# EAGLE design 4H-Charlieplex84 (EAGLE 7.5.0)
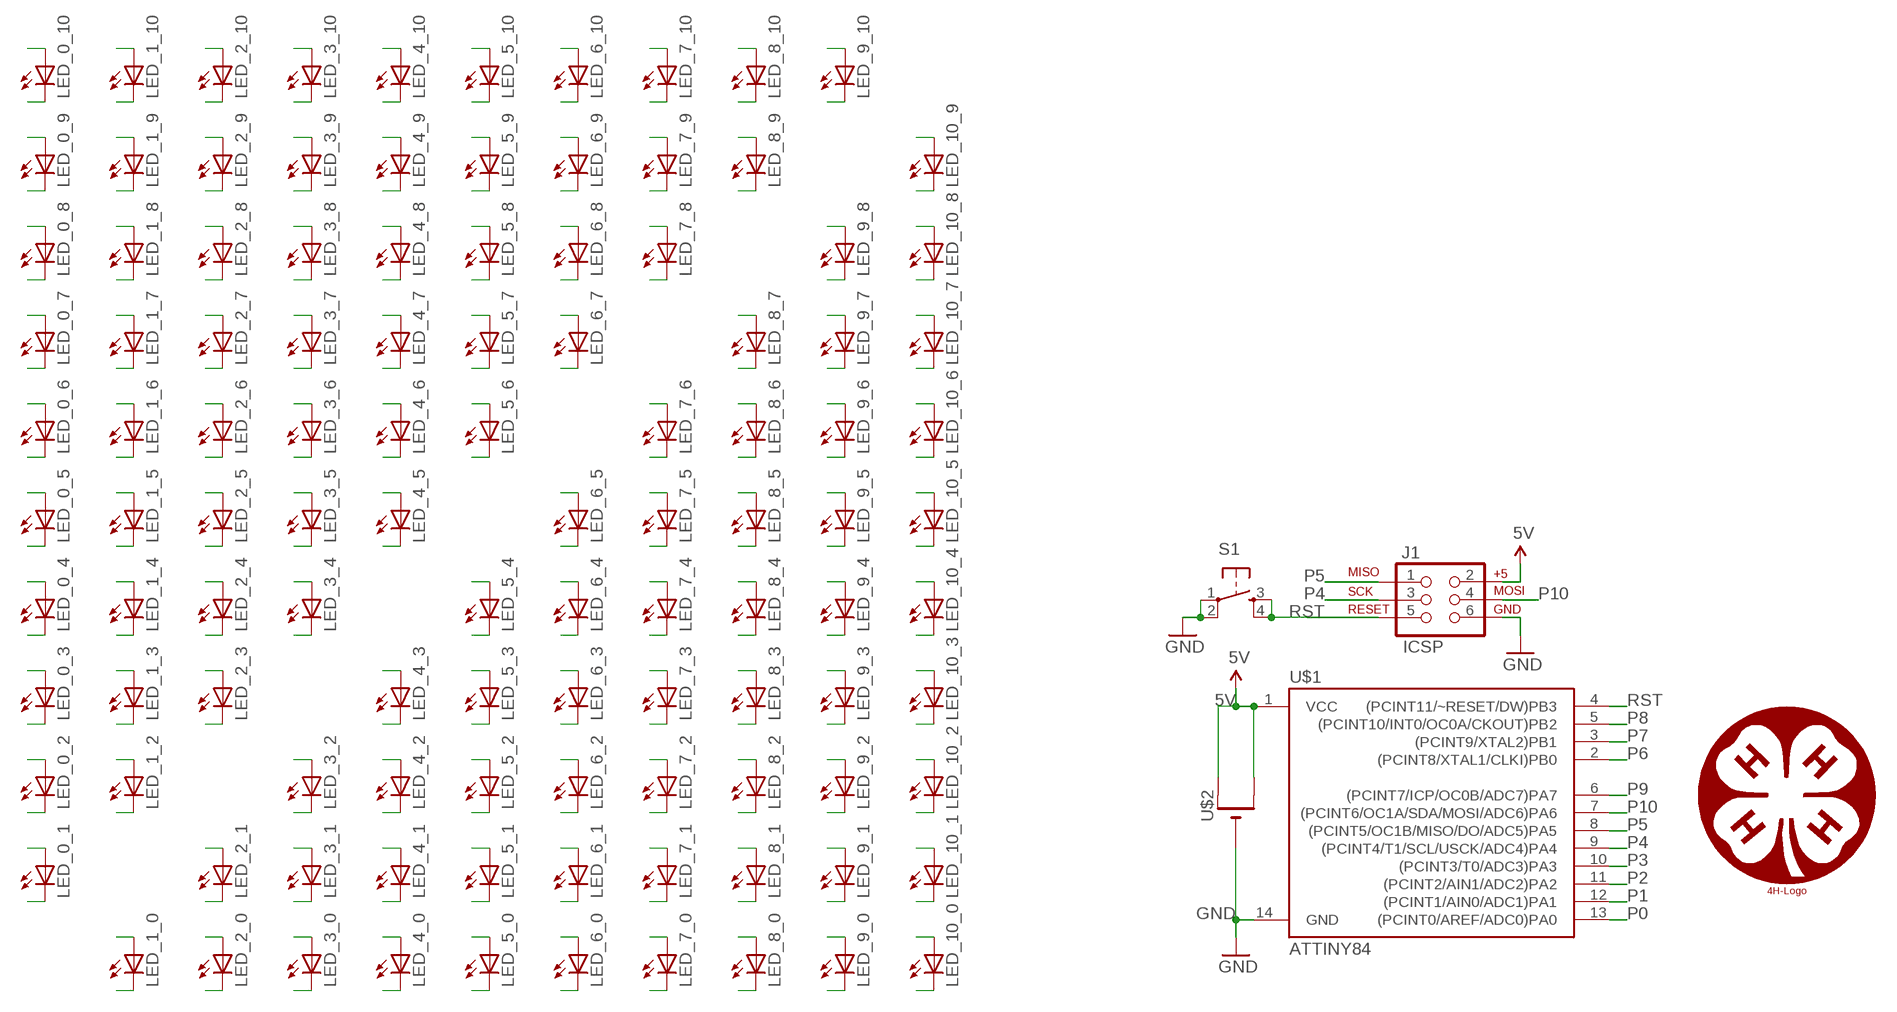
[diagram p0: schematic, sheet 1]

## Parts
J1  ICSP  AVR_SPI_PRG_6LABELED  [2X3-NS]
LED_0_1  LEDOVAL  [LED-OVAL]
LED_0_2  LEDOVAL  [LED-OVAL]
LED_0_3  LEDOVAL  [LED-OVAL]
LED_0_4  LEDOVAL  [LED-OVAL]
LED_0_5  LEDOVAL  [LED-OVAL]
LED_0_6  LEDOVAL  [LED-OVAL]
LED_0_7  LEDOVAL  [LED-OVAL]
LED_0_8  LEDOVAL  [LED-OVAL]
LED_0_9  LEDOVAL  [LED-OVAL]
LED_0_10  LEDOVAL  [LED-OVAL]
LED_1_0  LEDOVAL  [LED-OVAL]
LED_1_2  LEDOVAL  [LED-OVAL]
LED_1_3  LEDOVAL  [LED-OVAL]
LED_1_4  LEDOVAL  [LED-OVAL]
LED_1_5  LEDOVAL  [LED-OVAL]
LED_1_6  LEDOVAL  [LED-OVAL]
LED_1_7  LEDOVAL  [LED-OVAL]
LED_1_8  LEDOVAL  [LED-OVAL]
LED_1_9  LEDOVAL  [LED-OVAL]
LED_1_10  LEDOVAL  [LED-OVAL]
LED_2_0  LEDOVAL  [LED-OVAL]
LED_2_1  LEDOVAL  [LED-OVAL]
LED_2_3  LEDOVAL  [LED-OVAL]
LED_2_4  LEDOVAL  [LED-OVAL]
LED_2_5  LEDOVAL  [LED-OVAL]
LED_2_6  LEDOVAL  [LED-OVAL]
LED_2_7  LEDOVAL  [LED-OVAL]
LED_2_8  LEDOVAL  [LED-OVAL]
LED_2_9  LEDOVAL  [LED-OVAL]
LED_2_10  LEDOVAL  [LED-OVAL]
LED_3_0  LEDOVAL  [LED-OVAL]
LED_3_1  LEDOVAL  [LED-OVAL]
LED_3_2  LEDOVAL  [LED-OVAL]
LED_3_4  LEDOVAL  [LED-OVAL]
LED_3_5  LEDOVAL  [LED-OVAL]
LED_3_6  LEDOVAL  [LED-OVAL]
LED_3_7  LEDOVAL  [LED-OVAL]
LED_3_8  LEDOVAL  [LED-OVAL]
LED_3_9  LEDOVAL  [LED-OVAL]
LED_3_10  LEDOVAL  [LED-OVAL]
LED_4_0  LEDOVAL  [LED-OVAL]
LED_4_1  LEDOVAL  [LED-OVAL]
LED_4_2  LEDOVAL  [LED-OVAL]
LED_4_3  LEDOVAL  [LED-OVAL]
LED_4_5  LEDOVAL  [LED-OVAL]
LED_4_6  LEDOVAL  [LED-OVAL]
LED_4_7  LEDOVAL  [LED-OVAL]
LED_4_8  LEDOVAL  [LED-OVAL]
LED_4_9  LEDOVAL  [LED-OVAL]
LED_4_10  LEDOVAL  [LED-OVAL]
LED_5_0  LEDOVAL  [LED-OVAL]
LED_5_1  LEDOVAL  [LED-OVAL]
LED_5_2  LEDOVAL  [LED-OVAL]
LED_5_3  LEDOVAL  [LED-OVAL]
LED_5_4  LEDOVAL  [LED-OVAL]
LED_5_6  LEDOVAL  [LED-OVAL]
LED_5_7  LEDOVAL  [LED-OVAL]
LED_5_8  LEDOVAL  [LED-OVAL]
LED_5_9  LEDOVAL  [LED-OVAL]
LED_5_10  LEDOVAL  [LED-OVAL]
LED_6_0  LEDOVAL  [LED-OVAL]
LED_6_1  LEDOVAL  [LED-OVAL]
LED_6_2  LEDOVAL  [LED-OVAL]
LED_6_3  LEDOVAL  [LED-OVAL]
LED_6_4  LEDOVAL  [LED-OVAL]
LED_6_5  LEDOVAL  [LED-OVAL]
LED_6_7  LEDOVAL  [LED-OVAL]
LED_6_8  LEDOVAL  [LED-OVAL]
LED_6_9  LEDOVAL  [LED-OVAL]
LED_6_10  LEDOVAL  [LED-OVAL]
LED_7_0  LEDOVAL  [LED-OVAL]
LED_7_1  LEDOVAL  [LED-OVAL]
LED_7_2  LEDOVAL  [LED-OVAL]
LED_7_3  LEDOVAL  [LED-OVAL]
LED_7_4  LEDOVAL  [LED-OVAL]
LED_7_5  LEDOVAL  [LED-OVAL]
LED_7_6  LEDOVAL  [LED-OVAL]
LED_7_8  LEDOVAL  [LED-OVAL]
LED_7_9  LEDOVAL  [LED-OVAL]
LED_7_10  LEDOVAL  [LED-OVAL]
LED_8_0  LEDOVAL  [LED-OVAL]
LED_8_1  LEDOVAL  [LED-OVAL]
LED_8_2  LEDOVAL  [LED-OVAL]
LED_8_3  LEDOVAL  [LED-OVAL]
LED_8_4  LEDOVAL  [LED-OVAL]
LED_8_5  LEDOVAL  [LED-OVAL]
LED_8_6  LEDOVAL  [LED-OVAL]
LED_8_7  LEDOVAL  [LED-OVAL]
LED_8_9  LEDOVAL  [LED-OVAL]
LED_8_10  LEDOVAL  [LED-OVAL]
LED_9_0  LEDOVAL  [LED-OVAL]
LED_9_1  LEDOVAL  [LED-OVAL]
LED_9_2  LEDOVAL  [LED-OVAL]
LED_9_3  LEDOVAL  [LED-OVAL]
LED_9_4  LEDOVAL  [LED-OVAL]
LED_9_5  LEDOVAL  [LED-OVAL]
LED_9_6  LEDOVAL  [LED-OVAL]
LED_9_7  LEDOVAL  [LED-OVAL]
LED_9_8  LEDOVAL  [LED-OVAL]
LED_9_10  LEDOVAL  [LED-OVAL]
LED_10_0  LEDOVAL  [LED-OVAL]
LED_10_1  LEDOVAL  [LED-OVAL]
LED_10_2  LEDOVAL  [LED-OVAL]
LED_10_3  LEDOVAL  [LED-OVAL]
LED_10_4  LEDOVAL  [LED-OVAL]
LED_10_5  LEDOVAL  [LED-OVAL]
LED_10_6  LEDOVAL  [LED-OVAL]
LED_10_7  LEDOVAL  [LED-OVAL]
LED_10_8  LEDOVAL  [LED-OVAL]
LED_10_9  LEDOVAL  [LED-OVAL]
S1  TAC_SWITCHPTH  [TACTILE-PTH]
U$1  ATTINY84  ATTINY84ATTINY84-20PU  [DIL14]
U$2  CR2032THM  [CR2032-THRU]
U$3  4H-LOGO6  [4H_LOGO_6]

## Nets
5V: J1.2 U$1.1(VCC) U$2.+1(+) U$2.+2(+1)
GND: J1.6 S1.1 S1.2 U$1.14(GND) U$2.-
P0: LED_0_1.CATHODE(C) LED_0_2.CATHODE(C) LED_0_3.CATHODE(C) LED_0_4.CATHODE(C) LED_0_5.CATHODE(C) LED_0_6.CATHODE(C) LED_0_7.CATHODE(C) LED_0_8.CATHODE(C) LED_0_9.CATHODE(C) LED_0_10.CATHODE(C) LED_1_0.ANODE(A) LED_2_0.ANODE(A) LED_3_0.ANODE(A) LED_4_0.ANODE(A) LED_5_0.ANODE(A) LED_6_0.ANODE(A) LED_7_0.ANODE(A) LED_8_0.ANODE(A) LED_9_0.ANODE(A) LED_10_0.ANODE(A) U$1.13((PCINT0/AREF/ADC0)PA0)
P1: LED_0_1.ANODE(A) LED_1_0.CATHODE(C) LED_1_2.CATHODE(C) LED_1_3.CATHODE(C) LED_1_4.CATHODE(C) LED_1_5.CATHODE(C) LED_1_6.CATHODE(C) LED_1_7.CATHODE(C) LED_1_8.CATHODE(C) LED_1_9.CATHODE(C) LED_1_10.CATHODE(C) LED_2_1.ANODE(A) LED_3_1.ANODE(A) LED_4_1.ANODE(A) LED_5_1.ANODE(A) LED_6_1.ANODE(A) LED_7_1.ANODE(A) LED_8_1.ANODE(A) LED_9_1.ANODE(A) LED_10_1.ANODE(A) U$1.12((PCINT1/AIN0/ADC1)PA1)
P2: LED_0_2.ANODE(A) LED_1_2.ANODE(A) LED_2_0.CATHODE(C) LED_2_1.CATHODE(C) LED_2_3.CATHODE(C) LED_2_4.CATHODE(C) LED_2_5.CATHODE(C) LED_2_6.CATHODE(C) LED_2_7.CATHODE(C) LED_2_8.CATHODE(C) LED_2_9.CATHODE(C) LED_2_10.CATHODE(C) LED_3_2.ANODE(A) LED_4_2.ANODE(A) LED_5_2.ANODE(A) LED_6_2.ANODE(A) LED_7_2.ANODE(A) LED_8_2.ANODE(A) LED_9_2.ANODE(A) LED_10_2.ANODE(A) U$1.11((PCINT2/AIN1/ADC2)PA2)
P3: LED_0_3.ANODE(A) LED_1_3.ANODE(A) LED_2_3.ANODE(A) LED_3_0.CATHODE(C) LED_3_1.CATHODE(C) LED_3_2.CATHODE(C) LED_3_4.CATHODE(C) LED_3_5.CATHODE(C) LED_3_6.CATHODE(C) LED_3_7.CATHODE(C) LED_3_8.CATHODE(C) LED_3_9.CATHODE(C) LED_3_10.CATHODE(C) LED_4_3.ANODE(A) LED_5_3.ANODE(A) LED_6_3.ANODE(A) LED_7_3.ANODE(A) LED_8_3.ANODE(A) LED_9_3.ANODE(A) LED_10_3.ANODE(A) U$1.10((PCINT3/T0/ADC3)PA3)
P4: J1.3 LED_0_4.ANODE(A) LED_1_4.ANODE(A) LED_2_4.ANODE(A) LED_3_4.ANODE(A) LED_4_0.CATHODE(C) LED_4_1.CATHODE(C) LED_4_2.CATHODE(C) LED_4_3.CATHODE(C) LED_4_5.CATHODE(C) LED_4_6.CATHODE(C) LED_4_7.CATHODE(C) LED_4_8.CATHODE(C) LED_4_9.CATHODE(C) LED_4_10.CATHODE(C) LED_5_4.ANODE(A) LED_6_4.ANODE(A) LED_7_4.ANODE(A) LED_8_4.ANODE(A) LED_9_4.ANODE(A) LED_10_4.ANODE(A) U$1.9((PCINT4/T1/SCL/USCK/ADC4)PA4)
P5: J1.1 LED_0_5.ANODE(A) LED_1_5.ANODE(A) LED_2_5.ANODE(A) LED_3_5.ANODE(A) LED_4_5.ANODE(A) LED_5_0.CATHODE(C) LED_5_1.CATHODE(C) LED_5_2.CATHODE(C) LED_5_3.CATHODE(C) LED_5_4.CATHODE(C) LED_5_6.CATHODE(C) LED_5_7.CATHODE(C) LED_5_8.CATHODE(C) LED_5_9.CATHODE(C) LED_5_10.CATHODE(C) LED_6_5.ANODE(A) LED_7_5.ANODE(A) LED_8_5.ANODE(A) LED_9_5.ANODE(A) LED_10_5.ANODE(A) U$1.8((PCINT5/OC1B/MISO/DO/ADC5)PA5)
P6: LED_0_6.ANODE(A) LED_1_6.ANODE(A) LED_2_6.ANODE(A) LED_3_6.ANODE(A) LED_4_6.ANODE(A) LED_5_6.ANODE(A) LED_6_0.CATHODE(C) LED_6_1.CATHODE(C) LED_6_2.CATHODE(C) LED_6_3.CATHODE(C) LED_6_4.CATHODE(C) LED_6_5.CATHODE(C) LED_6_7.CATHODE(C) LED_6_8.CATHODE(C) LED_6_9.CATHODE(C) LED_6_10.CATHODE(C) LED_7_6.ANODE(A) LED_8_6.ANODE(A) LED_9_6.ANODE(A) LED_10_6.ANODE(A) U$1.2((PCINT8/XTAL1/CLKI)PB0)
P7: LED_0_7.ANODE(A) LED_1_7.ANODE(A) LED_2_7.ANODE(A) LED_3_7.ANODE(A) LED_4_7.ANODE(A) LED_5_7.ANODE(A) LED_6_7.ANODE(A) LED_7_0.CATHODE(C) LED_7_1.CATHODE(C) LED_7_2.CATHODE(C) LED_7_3.CATHODE(C) LED_7_4.CATHODE(C) LED_7_5.CATHODE(C) LED_7_6.CATHODE(C) LED_7_8.CATHODE(C) LED_7_9.CATHODE(C) LED_7_10.CATHODE(C) LED_8_7.ANODE(A) LED_9_7.ANODE(A) LED_10_7.ANODE(A) U$1.3((PCINT9/XTAL2)PB1)
P8: LED_0_8.ANODE(A) LED_1_8.ANODE(A) LED_2_8.ANODE(A) LED_3_8.ANODE(A) LED_4_8.ANODE(A) LED_5_8.ANODE(A) LED_6_8.ANODE(A) LED_7_8.ANODE(A) LED_8_0.CATHODE(C) LED_8_1.CATHODE(C) LED_8_2.CATHODE(C) LED_8_3.CATHODE(C) LED_8_4.CATHODE(C) LED_8_5.CATHODE(C) LED_8_6.CATHODE(C) LED_8_7.CATHODE(C) LED_8_9.CATHODE(C) LED_8_10.CATHODE(C) LED_9_8.ANODE(A) LED_10_8.ANODE(A) U$1.5((PCINT10/INT0/OC0A/CKOUT)PB2)
P9: LED_0_9.ANODE(A) LED_1_9.ANODE(A) LED_2_9.ANODE(A) LED_3_9.ANODE(A) LED_4_9.ANODE(A) LED_5_9.ANODE(A) LED_6_9.ANODE(A) LED_7_9.ANODE(A) LED_8_9.ANODE(A) LED_9_0.CATHODE(C) LED_9_1.CATHODE(C) LED_9_2.CATHODE(C) LED_9_3.CATHODE(C) LED_9_4.CATHODE(C) LED_9_5.CATHODE(C) LED_9_6.CATHODE(C) LED_9_7.CATHODE(C) LED_9_8.CATHODE(C) LED_9_10.CATHODE(C) LED_10_9.ANODE(A) U$1.6((PCINT7/ICP/OC0B/ADC7)PA7)
P10: J1.4 LED_0_10.ANODE(A) LED_1_10.ANODE(A) LED_2_10.ANODE(A) LED_3_10.ANODE(A) LED_4_10.ANODE(A) LED_5_10.ANODE(A) LED_6_10.ANODE(A) LED_7_10.ANODE(A) LED_8_10.ANODE(A) LED_9_10.ANODE(A) LED_10_0.CATHODE(C) LED_10_1.CATHODE(C) LED_10_2.CATHODE(C) LED_10_3.CATHODE(C) LED_10_4.CATHODE(C) LED_10_5.CATHODE(C) LED_10_6.CATHODE(C) LED_10_7.CATHODE(C) LED_10_8.CATHODE(C) LED_10_9.CATHODE(C) U$1.7((PCINT6/OC1A/SDA/MOSI/ADC6)PA6)
RST: J1.5 S1.3 S1.4 U$1.4((PCINT11/~RESET/DW)PB3)

## Library data of the parts
J1 = barbary_enterprises:AVR_SPI_PRG_6: AVR ISP 6 Pin This is the reduced ISP connector for AVR programming. Common on Arduino. This footprint will take up less PCB space and can be used with a 10-pin to 6-pin adapter such as SKU: BOB-08508
LED_0_1-LED_0_10 LED_1_0 LED_1_2-LED_1_10 LED_2_0 LED_2_1 LED_2_3-LED_2_10 LED_3_0 LED_3_1 LED_3_2 LED_3_4-LED_3_10 LED_4_0 LED_4_1-LED_4_3 LED_4_5-LED_4_10 LED_5_0 LED_5_1-LED_5_4 LED_5_6-LED_5_10 LED_6_0 LED_6_1-LED_6_5 LED_6_7-LED_6_10 LED_7_0 LED_7_1-LED_7_6 LED_7_8-LED_7_10 LED_8_0 LED_8_1-LED_8_7 LED_8_9 LED_8_10 LED_9_0 LED_9_1-LED_9_8 LED_9_10 LED_10_0 LED_10_1-LED_10_9 = barbary_enterprises:LED: LEDs Standard schematic elements and footprints for 5mm, 3mm, 1206, and 0603 sized LEDs. 5mm - Spark Fun Electronics SKU : COM-00529 (and others)
S1 = barbary_enterprises:TAC_SWITCH: Momentary Switch Button commonly used for reset or general input. Spark Fun Electronics SKU : COM-00097 SMT- SWCH-08247
U$1 = SparkFun-DigitalIC:ATTINY84: Atmel 14-pin 2/4/8kB flash uC
U$2 = battery:CR2032
U$3 = 4h:4H-LOGO: 18 USC 707

## Board
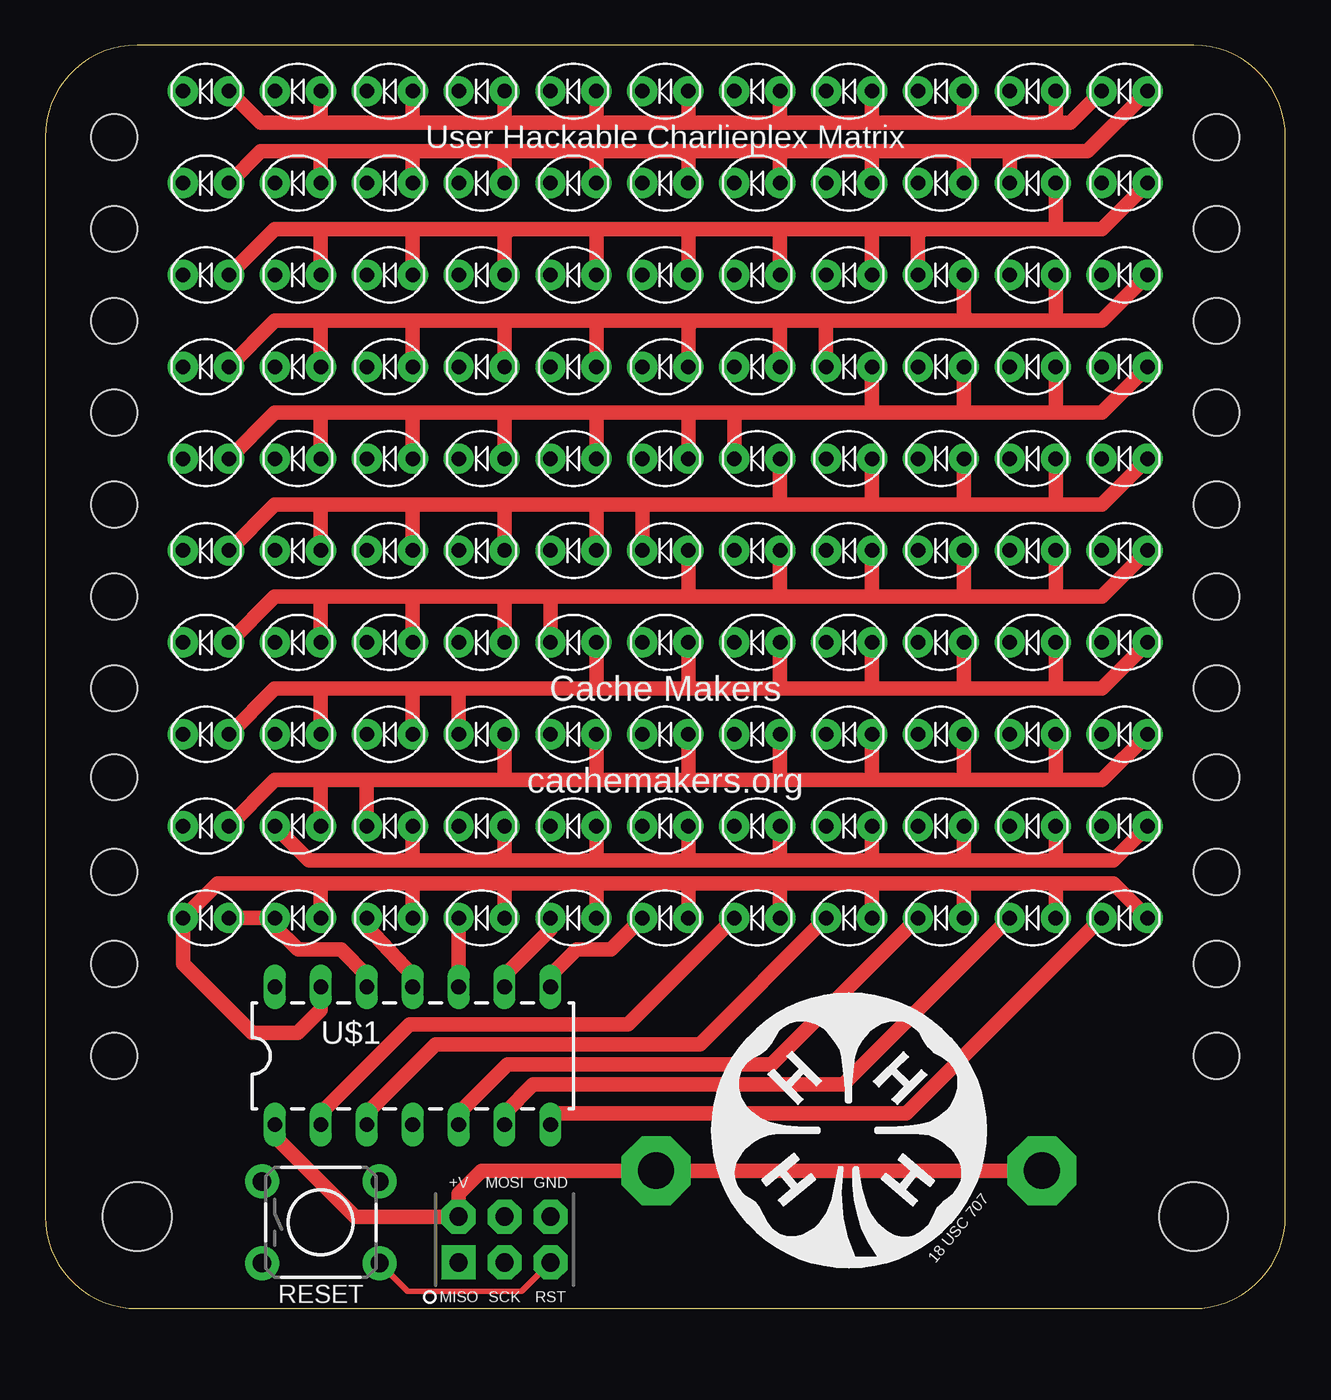
[diagram p1: board, top side]
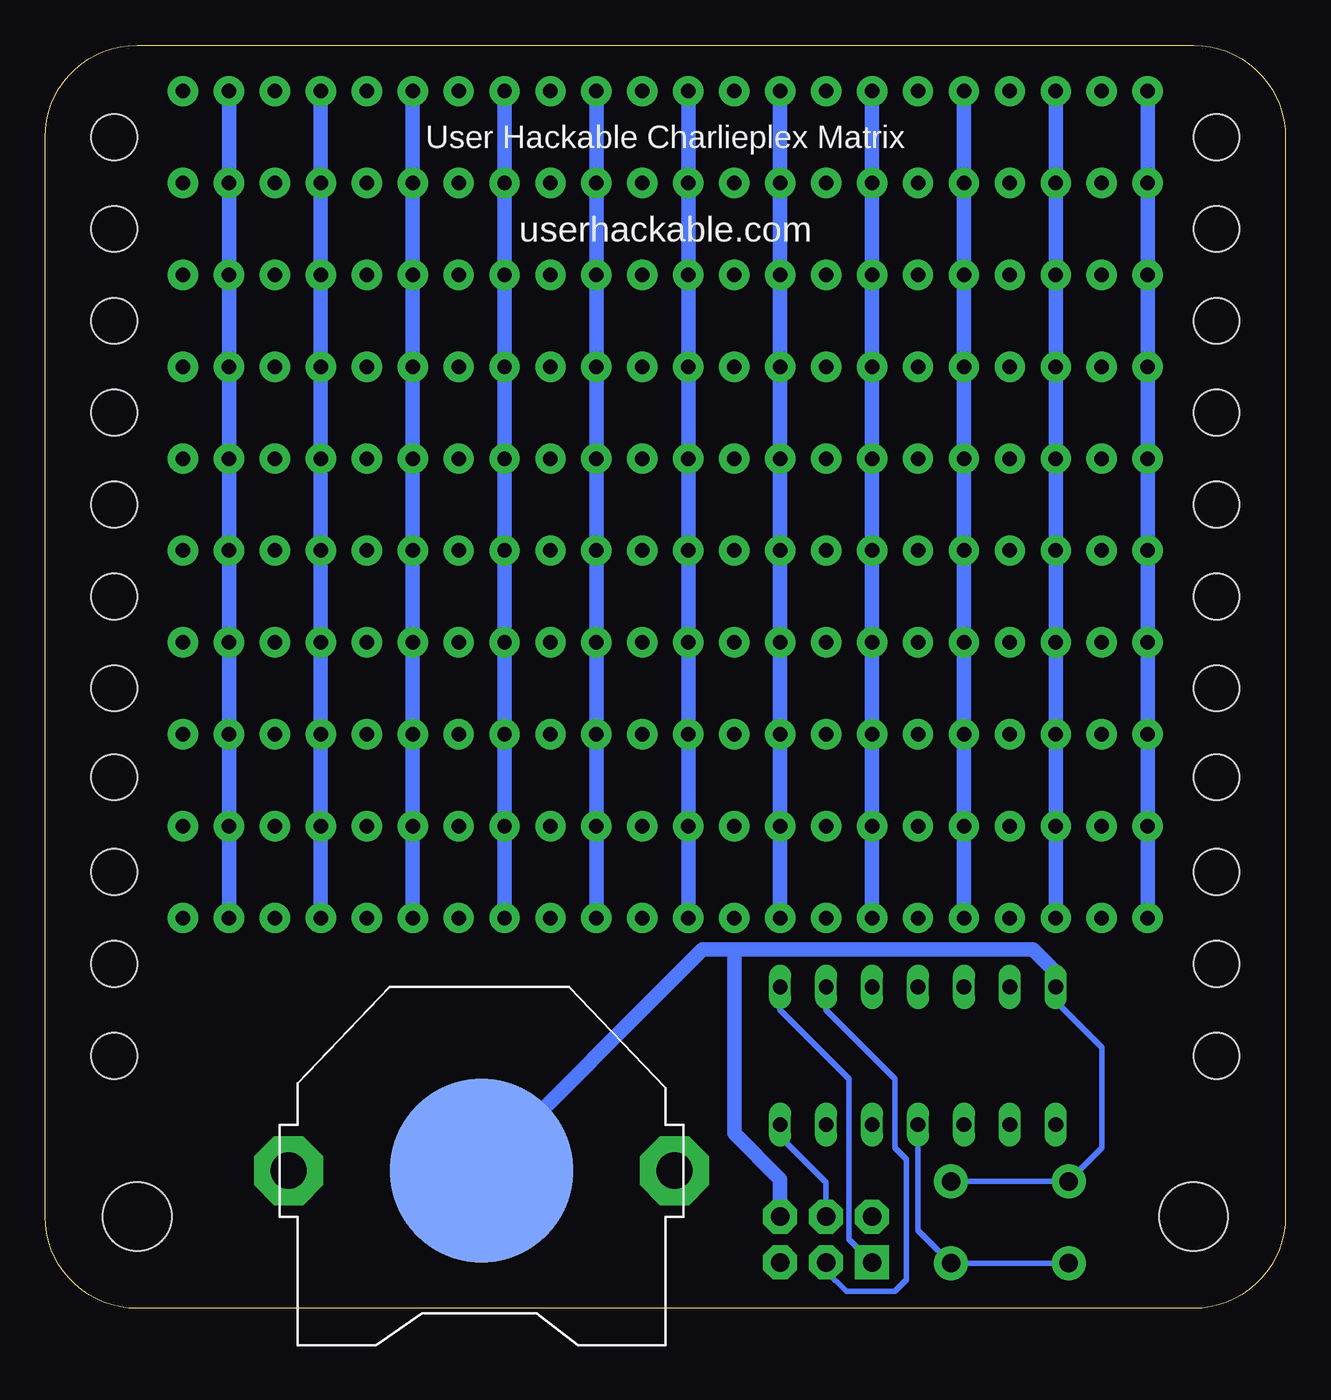
[diagram p2: board, bottom side, seen from below]

Size 68.58 x 69.85 mm. Coordinates in mm from the lower left corner, seen from the top.
Outline: 68.58,5.08 68.58,64.77 arc90 63.5,69.85 5.08,69.85 arc90 0,64.77 0,5.08 arc90 5.08,0 63.5,0 arc90 68.58,5.08
Copper layers (1*16): Top 0.0356mm / dielectric 1.5011mm / Bottom 0.0356mm
Design rules "LaenPCBOrder": minimum track width 6mil, minimum drill 13mil, track to track 6mil, track to pad 6mil, pad to pad 6mil, via to via 6mil, smd to smd 6mil, copper to edge 15mil, drill to drill 6mil, minimum pad ring 7mil, minimum via ring 7mil, stop-mask expansion 3mil, vias tented up to drill 0mil, thermal gap 10mil
Holes 2.54 mm at 3.81,64.77 64.77,64.77 3.81,24.13 64.77,24.13 3.81,29.37 3.81,34.29 3.81,39.37 3.81,44.45 3.81,49.53 3.81,59.69 3.81,54.61 64.77,29.37 64.77,34.29 64.77,39.37 64.77,44.45 64.77,49.53 64.77,59.69 64.77,54.61 64.77,19.05 3.81,19.05 3.81,13.97 64.77,13.97
Holes 3.81 mm at 63.5,5.08 5.08,5.08

### Footprints (pad centres in the part's own frame; a part is rotated, then mirrored left to right if it is on the bottom)
2X3-NS = drill 1.016 pad 1.88 square: 1 -2.54,-1.27 | drill 1.016 pad 1.88 octagon: 2 -2.54,1.27; 3 0,-1.27; 4 0,1.27; 5 2.54,-1.27; 6 2.54,1.27
LED-OVAL = drill 0.8 pad 1.676: ANODE 1.27,0; CATHODE -1.27,0
TACTILE-PTH = drill 1.016 pad 1.88: 1 -3.251,2.261; 2 3.251,2.261; 3 -3.251,-2.261; 4 3.251,-2.261
DIL14 = drill 0.813 long: 1 -8.89,-3.81; 2 -6.35,-3.81; 3 -3.81,-3.81; 4 -1.27,-3.81; 5 1.27,-3.81; 6 3.81,-3.81; 7 6.35,-3.81; 8 6.35,3.81; 9 3.81,3.81; 10 1.27,3.81; 11 -1.27,3.81; 12 -3.81,3.81; 13 -6.35,3.81; 14 -8.89,3.81
CR2032-THRU = drill 2 pad 3.81 octagon: +1 -10.668,0; +2 10.668,0 | smd 10.16 x 10.16: - 0,0

### Placement (x,y rotation side)
J1  25.4,3.81 0 top
LED_0_1  8.89,21.59 0 top
LED_0_2  8.89,26.67 0 top
LED_0_3  8.89,31.75 0 top
LED_0_4  8.89,36.83 0 top
LED_0_5  8.89,41.91 0 top
LED_0_6  8.89,46.99 0 top
LED_0_7  8.89,52.07 0 top
LED_0_8  8.89,57.15 0 top
LED_0_9  8.89,62.23 0 top
LED_0_10  8.89,67.31 0 top
LED_1_0  13.97,21.59 0 top
LED_1_2  13.97,26.67 0 top
LED_1_3  13.97,31.75 0 top
LED_1_4  13.97,36.83 0 top
LED_1_5  13.97,41.91 0 top
LED_1_6  13.97,46.99 0 top
LED_1_7  13.97,52.07 0 top
LED_1_8  13.97,57.15 0 top
LED_1_9  13.97,62.23 0 top
LED_1_10  13.97,67.31 0 top
LED_2_0  19.05,21.59 0 top
LED_2_1  19.05,26.67 0 top
LED_2_3  19.05,31.75 0 top
LED_2_4  19.05,36.83 0 top
LED_2_5  19.05,41.91 0 top
LED_2_6  19.05,46.99 0 top
LED_2_7  19.05,52.07 0 top
LED_2_8  19.05,57.15 0 top
LED_2_9  19.05,62.23 0 top
LED_2_10  19.05,67.31 0 top
LED_3_0  24.13,21.59 0 top
LED_3_1  24.13,26.67 0 top
LED_3_2  24.13,31.75 0 top
LED_3_4  24.13,36.83 0 top
LED_3_5  24.13,41.91 0 top
LED_3_6  24.13,46.99 0 top
LED_3_7  24.13,52.07 0 top
LED_3_8  24.13,57.15 0 top
LED_3_9  24.13,62.23 0 top
LED_3_10  24.13,67.31 0 top
LED_4_0  29.21,21.59 0 top
LED_4_1  29.21,26.67 0 top
LED_4_2  29.21,31.75 0 top
LED_4_3  29.21,36.83 0 top
LED_4_5  29.21,41.91 0 top
LED_4_6  29.21,46.99 0 top
LED_4_7  29.21,52.07 0 top
LED_4_8  29.21,57.15 0 top
LED_4_9  29.21,62.23 0 top
LED_4_10  29.21,67.31 0 top
LED_5_0  34.29,21.59 0 top
LED_5_1  34.29,26.67 0 top
LED_5_2  34.29,31.75 0 top
LED_5_3  34.29,36.83 0 top
LED_5_4  34.29,41.91 0 top
LED_5_6  34.29,46.99 0 top
LED_5_7  34.29,52.07 0 top
LED_5_8  34.29,57.15 0 top
LED_5_9  34.29,62.23 0 top
LED_5_10  34.29,67.31 0 top
LED_6_0  39.37,21.59 0 top
LED_6_1  39.37,26.67 0 top
LED_6_2  39.37,31.75 0 top
LED_6_3  39.37,36.83 0 top
LED_6_4  39.37,41.91 0 top
LED_6_5  39.37,46.99 0 top
LED_6_7  39.37,52.07 0 top
LED_6_8  39.37,57.15 0 top
LED_6_9  39.37,62.23 0 top
LED_6_10  39.37,67.31 0 top
LED_7_0  44.45,21.59 0 top
LED_7_1  44.45,26.67 0 top
LED_7_2  44.45,31.75 0 top
LED_7_3  44.45,36.83 0 top
LED_7_4  44.45,41.91 0 top
LED_7_5  44.45,46.99 0 top
LED_7_6  44.45,52.07 0 top
LED_7_8  44.45,57.15 0 top
LED_7_9  44.45,62.23 0 top
LED_7_10  44.45,67.31 0 top
LED_8_0  49.53,21.59 0 top
LED_8_1  49.53,26.67 0 top
LED_8_2  49.53,31.75 0 top
LED_8_3  49.53,36.83 0 top
LED_8_4  49.53,41.91 0 top
LED_8_5  49.53,46.99 0 top
LED_8_6  49.53,52.07 0 top
LED_8_7  49.53,57.15 0 top
LED_8_9  49.53,62.23 0 top
LED_8_10  49.53,67.31 0 top
LED_9_0  54.61,21.59 0 top
LED_9_1  54.61,26.67 0 top
LED_9_2  54.61,31.75 0 top
LED_9_3  54.61,36.83 0 top
LED_9_4  54.61,41.91 0 top
LED_9_5  54.61,46.99 0 top
LED_9_6  54.61,52.07 0 top
LED_9_7  54.61,57.15 0 top
LED_9_8  54.61,62.23 0 top
LED_9_10  54.61,67.31 0 top
LED_10_0  59.69,21.59 0 top
LED_10_1  59.69,26.67 0 top
LED_10_2  59.69,31.75 0 top
LED_10_3  59.69,36.83 0 top
LED_10_4  59.69,41.91 0 top
LED_10_5  59.69,46.99 0 top
LED_10_6  59.69,52.07 0 top
LED_10_7  59.69,57.15 0 top
LED_10_8  59.69,62.23 0 top
LED_10_9  59.69,67.31 0 top
S1  15.24,4.76 0 top
U$1  21.59,13.97 0 top
U$2  44.45,7.62 180 bottom
U$3  44.45,9.84 0 top

### Tracks (layer width: path | path; a pad name or v marks a point on that pad's centre or on a via)
5V
  Top 0.813: U$2.+2 U$2.+1 24.13,7.62 22.86,6.35 J1.2 17.14,5.08 12.7,9.53 U$1.1
GND
  Bottom 0.305: 11.99,7.06 10.16,8.89 10.16,14.45 12.7,16.99 U$1.14 | S1.2 S1.1
  Bottom 0.813: U$1.14 12.7,18.57 13.97,19.84 30.48,19.84 | 30.48,19.84 32.23,19.84 U$2.- | J1.6 27.94,7.14 30.48,9.68 30.48,19.84 | S1.1 11.99,7.06
P0
  Top 0.813: 15.24,23.5 9.53,23.5 LED_0_1.CATHODE 7.62,19.05 11.43,15.24 13.97,15.24 15.24,16.51 U$1.13 | 15.24,23.5 20.32,23.5 | 20.32,23.5 25.4,23.5 | 25.4,23.5 30.48,23.5 | 30.48,23.5 35.56,23.5 | 35.56,23.5 40.64,23.5 | 40.64,23.5 45.4,23.5 | 45.4,23.5 50.8,23.5 | 50.8,23.5 55.88,23.5 | 55.88,23.5 59.05,23.5 LED_10_0.ANODE | LED_1_0.ANODE 15.24,23.5 | LED_2_0.ANODE 20.32,23.5 | LED_3_0.ANODE 25.4,23.5 | LED_4_0.ANODE 30.48,23.5 | LED_5_0.ANODE 35.56,23.5 | LED_6_0.ANODE 40.64,23.5 | LED_7_0.ANODE 45.72,23.18 45.4,23.5 | LED_8_0.ANODE 50.8,23.5 | LED_9_0.ANODE 55.88,23.5
  Bottom 0.813: LED_0_10.CATHODE LED_0_9.CATHODE LED_0_8.CATHODE LED_0_7.CATHODE LED_0_6.CATHODE LED_0_5.CATHODE LED_0_4.CATHODE LED_0_3.CATHODE LED_0_2.CATHODE LED_0_1.CATHODE
P1
  Top 0.813: 20.32,24.77 14.61,24.77 LED_1_2.CATHODE | 20.32,24.77 25.4,24.77 | 25.4,24.77 30.48,24.77 | 30.48,24.77 35.56,24.77 | 35.56,24.77 40.64,24.77 | 40.64,24.77 45.72,24.77 | 45.72,24.77 50.8,24.77 | 50.8,24.77 55.88,24.77 | 55.88,24.77 59.05,24.77 LED_10_1.ANODE | LED_9_1.ANODE 55.88,24.77 | LED_8_1.ANODE 50.8,24.77 | LED_7_1.ANODE 45.72,24.77 | LED_6_1.ANODE 40.64,24.77 | LED_5_1.ANODE 35.56,24.77 | LED_4_1.ANODE 30.48,24.77 | LED_3_1.ANODE 25.4,24.77 | LED_2_1.ANODE 20.32,24.77 | LED_0_1.ANODE LED_1_0.CATHODE 12.7,21.12 13.98,19.84 16.35,19.84 17.78,18.41 U$1.12
  Bottom 0.813: LED_1_0.CATHODE LED_1_2.CATHODE LED_1_3.CATHODE LED_1_4.CATHODE LED_1_5.CATHODE LED_1_6.CATHODE LED_1_7.CATHODE LED_1_8.CATHODE LED_1_9.CATHODE LED_1_10.CATHODE
P2
  Top 0.813: LED_0_2.ANODE 12.7,29.21 15.24,29.21 | 15.24,29.21 17.78,29.21 | 17.78,29.21 25.4,29.21 | 25.4,29.21 30.48,29.21 | 30.48,29.21 35.56,29.21 | 35.56,29.21 40.64,29.21 | 40.64,29.21 45.72,29.21 | 45.72,29.21 50.8,29.21 | 50.8,29.21 55.88,29.21 | 55.88,29.21 58.42,29.21 LED_10_2.ANODE | LED_1_2.ANODE 15.24,29.21 | LED_2_1.CATHODE 17.78,29.21 | LED_3_2.ANODE 25.4,29.21 | LED_4_2.ANODE 30.48,29.21 | LED_5_2.ANODE 35.56,29.21 | LED_6_2.ANODE 40.64,29.21 | LED_7_2.ANODE 45.72,29.21 | LED_8_2.ANODE 50.8,29.21 | LED_9_2.ANODE 55.88,29.21 | LED_2_0.CATHODE 17.78,21.11 20.32,18.41 U$1.11
  Bottom 0.813: LED_2_10.CATHODE LED_2_9.CATHODE LED_2_8.CATHODE LED_2_7.CATHODE LED_2_6.CATHODE LED_2_5.CATHODE LED_2_4.CATHODE LED_2_3.CATHODE LED_2_1.CATHODE LED_2_0.CATHODE
P3
  Top 0.813: LED_0_3.ANODE 12.7,34.29 15.24,34.29 | 15.24,34.29 20.32,34.29 | 20.32,34.29 22.86,34.29 | 22.86,34.29 30.48,34.29 | 30.48,34.29 35.56,34.29 | 35.56,34.29 40.64,34.29 | 40.64,34.29 45.72,34.29 | 45.72,34.29 50.8,34.29 | 50.8,34.29 55.88,34.29 | 55.88,34.29 58.42,34.29 LED_10_3.ANODE | LED_1_3.ANODE 15.24,34.29 | LED_2_3.ANODE 20.32,34.29 | LED_3_2.CATHODE 22.86,34.29 | LED_9_3.ANODE 55.88,34.29 | LED_8_3.ANODE 50.8,34.29 | LED_7_3.ANODE 45.72,34.29 | LED_6_3.ANODE 40.64,34.29 | LED_5_3.ANODE 35.56,34.29 | LED_4_3.ANODE 30.48,34.29 | LED_3_0.CATHODE U$1.10
  Bottom 0.813: LED_3_10.CATHODE LED_3_9.CATHODE LED_3_8.CATHODE LED_3_7.CATHODE LED_3_6.CATHODE LED_3_5.CATHODE LED_3_4.CATHODE LED_3_2.CATHODE LED_3_1.CATHODE LED_3_0.CATHODE
P4
  Top 0.813: LED_0_4.ANODE 12.7,39.37 15.24,39.37 | 15.24,39.37 20.32,39.37 | 20.32,39.37 25.4,39.37 | 25.4,39.37 27.94,39.37 | 27.94,39.37 35.56,39.37 | 35.56,39.37 40.8,39.37 | 40.8,39.37 45.88,39.37 | 45.88,39.37 50.96,39.37 | 50.96,39.37 55.72,39.37 | 55.72,39.37 58.42,39.37 LED_10_4.ANODE | LED_3_4.ANODE 25.4,39.37 | LED_4_3.CATHODE 27.94,39.37 | LED_2_4.ANODE 20.32,39.37 | LED_1_4.ANODE 15.24,39.37 | LED_4_0.CATHODE 27.94,20.95 25.4,18.41 U$1.9 | LED_5_4.ANODE 35.56,39.37 | LED_6_4.ANODE 40.64,39.53 40.8,39.37 | LED_7_4.ANODE 45.72,39.53 45.88,39.37 | LED_8_4.ANODE 50.8,39.53 50.96,39.37 | LED_9_4.ANODE 55.88,39.53 55.72,39.37
  Bottom 0.305: U$1.9 25.4,16.51 21.59,12.7 21.59,8.89 20.95,8.26 20.95,1.59 21.59,0.95 24.29,0.95 25.4,2.06 J1.3
  Bottom 0.813: LED_4_10.CATHODE LED_4_9.CATHODE LED_4_8.CATHODE LED_4_7.CATHODE LED_4_6.CATHODE LED_4_5.CATHODE LED_4_3.CATHODE LED_4_2.CATHODE LED_4_1.CATHODE LED_4_0.CATHODE
P5
  Top 0.813: LED_0_5.ANODE 12.7,44.45 15.24,44.45 | 15.24,44.45 20.32,44.45 | 20.32,44.45 25.4,44.45 | 25.4,44.45 30.48,44.45 | 30.48,44.45 33.02,44.45 | 33.02,44.45 40.64,44.45 | 40.64,44.45 45.72,44.45 | 45.72,44.45 50.8,44.45 | 50.8,44.45 55.88,44.45 | 55.88,44.45 58.42,44.45 LED_10_5.ANODE | LED_9_5.ANODE 55.88,44.45 | LED_8_5.ANODE 50.8,44.45 | LED_6_5.ANODE 40.64,44.45 | LED_7_5.ANODE 45.72,44.45 | LED_1_5.ANODE 15.24,44.45 | LED_2_5.ANODE 20.32,44.45 | LED_3_5.ANODE 25.4,44.45 | LED_4_5.ANODE 30.48,44.45 | LED_5_4.CATHODE 33.02,44.45 | LED_5_0.CATHODE 31.27,19.84 29.37,19.84 27.94,18.41 U$1.8
  Bottom 0.305: U$1.8 27.94,16.51 24.13,12.7 24.13,3.81 J1.1
  Bottom 0.813: LED_5_10.CATHODE LED_5_9.CATHODE LED_5_8.CATHODE LED_5_7.CATHODE LED_5_6.CATHODE LED_5_4.CATHODE LED_5_3.CATHODE LED_5_2.CATHODE LED_5_1.CATHODE LED_5_0.CATHODE
P6
  Top 0.813: LED_0_6.ANODE 12.7,49.53 15.24,49.53 | 15.24,49.53 20.32,49.53 | 20.32,49.53 25.4,49.53 | 25.4,49.53 30.48,49.53 | 30.48,49.53 35.56,49.53 | 35.56,49.53 38.1,49.53 | 38.1,49.53 45.72,49.53 | 45.72,49.53 50.8,49.53 | 50.8,49.53 55.88,49.53 | 55.88,49.53 58.42,49.53 LED_10_6.ANODE | LED_9_6.ANODE 55.88,49.53 | LED_8_6.ANODE 50.8,49.53 | LED_7_6.ANODE 45.72,49.53 | LED_5_6.ANODE 35.56,49.53 | LED_6_5.CATHODE 38.1,49.53 | LED_4_6.ANODE 30.48,49.53 | LED_3_6.ANODE 25.4,49.53 | LED_2_6.ANODE 20.32,49.53 | LED_1_6.ANODE 15.24,49.53 | U$1.2 15.24,10.79 20.16,15.72 32.23,15.72 LED_6_0.CATHODE
  Bottom 0.813: LED_6_10.CATHODE LED_6_9.CATHODE LED_6_8.CATHODE LED_6_7.CATHODE LED_6_5.CATHODE LED_6_4.CATHODE LED_6_3.CATHODE LED_6_2.CATHODE LED_6_1.CATHODE LED_6_0.CATHODE
P7
  Top 0.813: LED_10_7.ANODE 58.42,54.61 55.88,54.61 | 55.88,54.61 51.12,54.61 | 51.12,54.61 43.18,54.61 | 43.18,54.61 40.64,54.61 | 40.64,54.61 35.88,54.61 | 35.88,54.61 30.48,54.61 | 30.48,54.61 25.4,54.61 | 25.4,54.61 20.32,54.61 | 20.32,54.61 15.24,54.61 | 15.24,54.61 12.7,54.61 LED_0_7.ANODE | LED_1_7.ANODE 15.24,54.61 | LED_2_7.ANODE 20.32,54.61 | LED_3_7.ANODE 25.4,54.61 | LED_4_7.ANODE 30.48,54.61 | LED_5_7.ANODE 35.56,54.29 35.88,54.61 | LED_6_7.ANODE 40.64,54.61 | LED_7_6.CATHODE 43.18,54.61 | LED_9_7.ANODE 55.88,54.61 | LED_8_7.ANODE 50.8,54.93 51.12,54.61 | U$1.3 17.78,10.79 21.59,14.61 36.2,14.61 LED_7_0.CATHODE
  Bottom 0.813: LED_7_10.CATHODE LED_7_9.CATHODE LED_7_8.CATHODE LED_7_6.CATHODE LED_7_5.CATHODE LED_7_4.CATHODE LED_7_3.CATHODE LED_7_2.CATHODE LED_7_1.CATHODE LED_7_0.CATHODE
P8
  Top 0.813: LED_10_8.ANODE 58.42,59.69 55.88,59.69 | 55.88,59.69 48.58,59.69 | 48.58,59.69 45.72,59.69 | 45.72,59.69 40.64,59.69 | 40.64,59.69 35.56,59.69 | 35.56,59.69 30.48,59.69 | 30.48,59.69 25.72,59.69 | 25.72,59.69 20.32,59.69 | 20.32,59.69 15.24,59.69 | 15.24,59.69 12.7,59.69 LED_0_8.ANODE | LED_9_8.ANODE 55.88,59.69 | LED_1_8.ANODE 15.24,59.69 | LED_2_8.ANODE 20.32,59.69 | LED_3_8.ANODE 25.4,59.37 25.72,59.69 | LED_4_8.ANODE 30.48,59.69 | LED_5_8.ANODE 35.56,59.69 | LED_6_8.ANODE 40.64,59.69 | LED_7_8.ANODE 45.72,59.69 | LED_8_7.CATHODE 48.26,59.37 48.58,59.69 | U$1.5 22.86,10.79 25.56,13.49 40.16,13.49 LED_8_0.CATHODE
  Bottom 0.813: LED_8_10.CATHODE LED_8_9.CATHODE LED_8_7.CATHODE LED_8_6.CATHODE LED_8_5.CATHODE LED_8_4.CATHODE LED_8_3.CATHODE LED_8_2.CATHODE LED_8_1.CATHODE LED_8_0.CATHODE
P9
  Top 0.813: LED_10_9.ANODE 57.63,63.98 53.34,63.98 | 53.34,63.98 50.64,63.98 | 50.64,63.98 45.72,63.98 | 45.72,63.98 40.64,63.98 | 40.64,63.98 35.56,63.98 | 35.56,63.98 30.48,63.98 | 30.48,63.98 25.4,63.98 | 25.4,63.98 20.32,63.98 | 20.32,63.98 15.24,63.98 | 15.24,63.98 11.91,63.98 LED_0_9.ANODE | LED_1_9.ANODE 15.24,63.98 | LED_2_9.ANODE 20.32,63.98 | LED_3_9.ANODE 25.4,63.98 | LED_4_9.ANODE 30.48,63.98 | LED_5_9.ANODE 35.56,63.98 | LED_6_9.ANODE 40.64,63.98 | LED_7_9.ANODE 45.72,63.98 | LED_8_9.ANODE 50.8,63.5 50.64,63.98 | LED_9_8.CATHODE 53.34,63.98 | U$1.6 25.4,10.79 26.99,12.38 44.13,12.38 LED_9_0.CATHODE
  Bottom 0.813: LED_9_10.CATHODE LED_9_8.CATHODE LED_9_7.CATHODE LED_9_6.CATHODE LED_9_5.CATHODE LED_9_4.CATHODE LED_9_3.CATHODE LED_9_2.CATHODE LED_9_1.CATHODE LED_9_0.CATHODE
P10
  Top 0.813: LED_0_10.ANODE 11.91,65.56 15.24,65.56 | 15.24,65.56 20.32,65.56 | 20.32,65.56 25.4,65.56 | 25.4,65.56 30.48,65.56 | 30.48,65.56 35.56,65.56 | 35.56,65.56 40.64,65.56 | 40.64,65.56 45.72,65.56 | 45.72,65.56 50.8,65.56 | 50.8,65.56 55.88,65.56 | 55.88,65.56 56.67,65.56 LED_10_9.CATHODE | LED_9_10.ANODE 55.88,65.56 | LED_8_10.ANODE 50.8,65.56 | LED_7_10.ANODE 45.72,65.56 | LED_6_10.ANODE 40.64,65.56 | LED_5_10.ANODE 35.56,65.56 | LED_4_10.ANODE 30.48,65.56 | LED_3_10.ANODE 25.4,65.56 | LED_2_10.ANODE 20.32,65.56 | LED_1_10.ANODE 15.24,65.56 | U$1.7 27.94,10.79 47.62,10.79 LED_10_0.CATHODE
  Bottom 0.305: U$1.7 27.94,9.53 25.4,6.99 J1.4
  Bottom 0.813: LED_10_9.CATHODE LED_10_8.CATHODE LED_10_7.CATHODE LED_10_6.CATHODE LED_10_5.CATHODE LED_10_4.CATHODE LED_10_3.CATHODE LED_10_2.CATHODE LED_10_1.CATHODE LED_10_0.CATHODE
RST
  Top 0.305: J1.5 26.35,0.95 20.04,0.95 S1.4
  Bottom 0.305: U$1.4 20.32,4.33 S1.4 S1.3

### Text on the board
tPlace: User Hackable Charlieplex Matrix | Cache Makers | cachemakers.org | 18 USC 707 | RESET
bPlace: User Hackable Charlieplex Matrix | userhackable.com